# EAGLE design temp sensor (EAGLE 6.4)
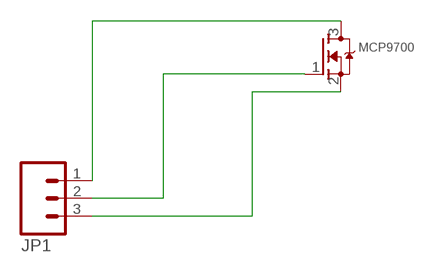
[diagram p0: schematic, sheet 1]

## Parts
JP1  M03PTH  [1X03]
MCP9700  MOSFET-NREFLOW  [SOT23]

## Nets
N$1: JP1.1 MCP9700.3(D)
N$2: JP1.2 MCP9700.1(G)
N$3: JP1.3 MCP9700.2(S)

## Library data of the parts
JP1 = SparkFun-Connectors:M03: Header 3 Standard 3-pin 0.1" header. Use with straight break away headers (SKU : PRT-00116), right angle break away headers (PRT-00553), swiss pins (PRT-00743), machine pins (PRT-00117), and female headers (PRT-00115). Molex polarized connector foot print use with SKU : PRT-08232 with associated crimp pins and housings.
MCP9700 = adafruit:MOSFET-N: N-Channel Mosfet 2N7002E - 60V 260mA SOT23 [Digikey: 2N7002ET1GOSTR-ND] - REEL BSH103 - 30V 850mA SOT23 [Digikey: 568-5013-1-ND]

## Board
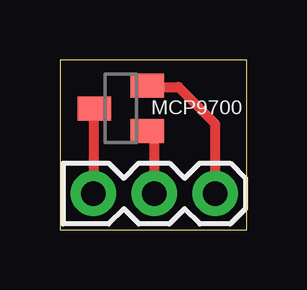
[diagram p1: board, top side]
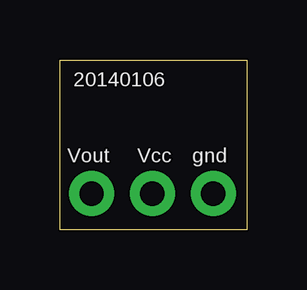
[diagram p2: board, bottom side, seen from below]

Size 7.8 x 7.1 mm. Coordinates in mm from the lower left corner, seen from the top.
Outline: 0,0 7.8,0 7.8,7.1 0,7.1 0,0
Copper layers (1*16): Top 0.0356mm / dielectric 1.5011mm / Bottom 0.0356mm
Design rules "LaenPCBOrder2": minimum track width 6mil, minimum drill 13mil, track to track 6mil, track to pad 6mil, pad to pad 6mil, via to via 6mil, smd to smd 6mil, copper to edge 15mil, drill to drill 6mil, minimum pad ring 7mil, minimum via ring 7mil, stop-mask expansion 4mil, vias tented up to drill 0mil, thermal gap 10mil

### Footprints (pad centres in the part's own frame; a part is rotated, then mirrored left to right if it is on the bottom)
1X03 = drill 1.016 pad 1.88: 1 0,0; 2 2.54,0; 3 5.08,0
SOT23 = smd 1 x 1.4: 1 -0.95,-1.1; 2 0.95,-1.1; 3 0,1.1

### Placement (x,y rotation side)
JP1  1.4,1.52 0 top
MCP9700  2.54,5.08 90 top

### Tracks (layer width: path | path; a pad name or v marks a point on that pad's centre or on a via)
N$1
  Top 0.406: MCP9700.3 1.4,5.08 JP1.1
N$2
  Top 0.406: MCP9700.1 3.94,4.13 JP1.2
N$3
  Top 0.406: MCP9700.2 3.7,5.97 4.95,5.97 6.48,4.45 JP1.3

### Text on the board
bPlace: 20140106 | gnd | Vcc | Vout